# EAGLE design ArduinoProMini_IOShield (EAGLE 8.3.2)
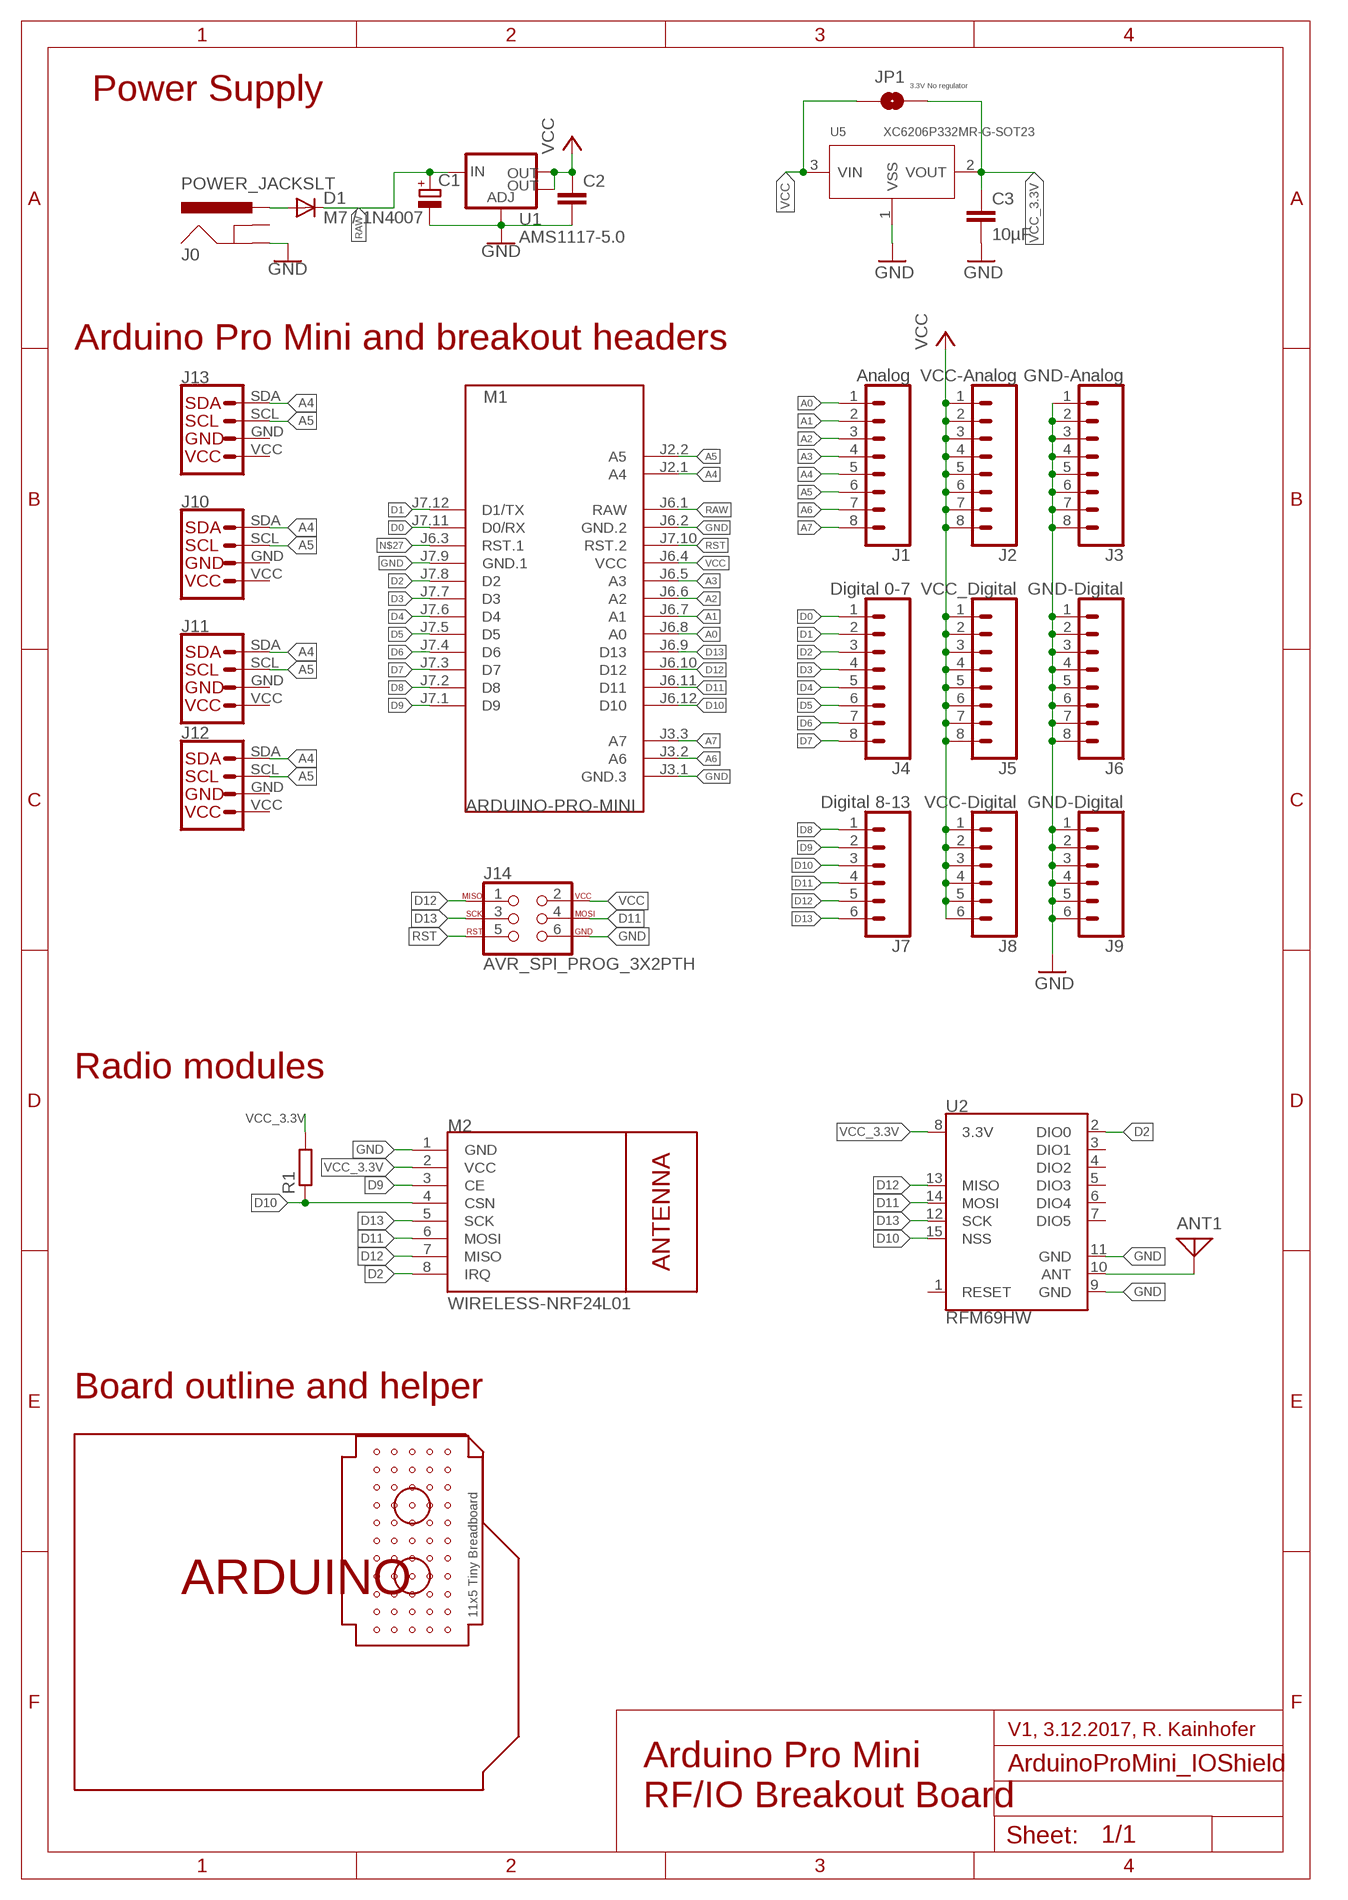
[diagram p0: schematic, sheet 1]

## Parts
ANT1  ANTENNA  [PAD-01]
B1  ARDUINO_DIMENSION-DIMENSION  [ARDUINOR3]
C1  CPOL-EU153CLV-0605  [153CLV-0605]
C2  C-EUC0805  [C0805]
C3  10µF  C-EUC0805  [C0805]
D1  M7 / 1N4007  DIODE-DO-214AC  [DO-214AC]
J0  POWER_JACKSLT  [POWER_JACK_SLOT]
J1  Analog  CONN_08"  [1X08]
J2  VCC-Analog  CONN_08"  [1X08]
J3  GND-Analog  CONN_08"  [1X08]
J4  Digital 0-7  CONN_08"  [1X08]
J5  VCC_Digital  CONN_08"  [1X08]
J6  GND-Digital  CONN_08"  [1X08]
J7  Digital 8-13  CONN_06SILK_FEMALE_PTH  [1X06]
J8  VCC-Digital  CONN_06SILK_FEMALE_PTH  [1X06]
J9  GND-Digital  CONN_06SILK_FEMALE_PTH  [1X06]
J10  I2C_CONN_VGLA  [1X04]
J11  I2C_CONN_VGLA  [1X04]
J12  I2C_CONN_VGLA  [1X04]
J13  I2C_CONN_VGLA  [1X04]
J14  AVR_SPI_PROG_3X2PTH  [2X3]
JP1  3.3V No regulator  JUMPER-SMT_2_NO_SILK  [SMT-JUMPER_2_NO_SILK]
M1  ARDUINO-PRO-MINI  ARDUINO-PRO-MINI-3.3V#NP  [ARDUINO-PRO-MINI#NP]
M2  WIRELESS-NRF24L01  [WIRELESS-NRF24L01]
R1  R-EU_R0805  [R0805]
U1  AMS1117-5.0  V_REG_LM1117SOT223  [SOT223]
U2  RFM69HW  [RFM69W-XXXS2]
U5  XC6206P332MR-G-SOT23  PMIC-LDO-XC6206P332MR-G(SOT23)  [SOT-23]
U$1  MINI_BREADBOARD  [MINI_BREADBOARD_11X5]

## Nets
A0: J1.1 M1.J6.8(A0)
A1: J1.2 M1.J6.7(A1)
A2: J1.3 M1.J6.6(A2)
A3: J1.4 M1.J6.5(A3)
A4: J1.5 J10.SDA J11.SDA J12.SDA J13.SDA M1.J2.1(A4)
A5: J1.6 J10.SCL J11.SCL J12.SCL J13.SCL M1.J2.2(A5)
A6: J1.7 M1.J3.2(A6)
A7: J1.8 M1.J3.3(A7)
D0: J4.1 M1.J7.11(D0/RX)
D1: J4.2 M1.J7.12(D1/TX)
D2: J4.3 M1.J7.8(D2) M2.8(IRQ) U2.2(DIO0)
D3: J4.4 M1.J7.7(D3)
D4: J4.5 M1.J7.6(D4)
D5: J4.6 M1.J7.5(D5)
D6: J4.7 M1.J7.4(D6)
D7: J4.8 M1.J7.3(D7)
D8: J7.1 M1.J7.2(D8)
D9: J7.2 M1.J7.1(D9) M2.3(CE)
D10: J7.3 M1.J6.12(D10) M2.4(CSN) R1.1 U2.15(NSS)
D11: J7.4 J14.4 M1.J6.11(D11) M2.6(MOSI) U2.14(MOSI)
D12: J7.5 J14.1 M1.J6.10(D12) M2.7(MISO) U2.13(MISO)
D13: J7.6 J14.3 M1.J6.9(D13) M2.5(SCK) U2.12(SCK)
GND: C1.- C2.2 C3.2 J0.GND@2(GND) J3.1 J3.2 J3.3 J3.4 J3.5 J3.6 J3.7 J3.8 J6.1 J6.2 J6.3 J6.4 J6.5 J6.6 J6.7 J6.8 J9.1 J9.2 J9.3 J9.4 J9.5 J9.6 J14.6 M1.J3.1(GND.3) M1.J6.2(GND.2) M1.J7.9(GND.1) M2.1(GND) U1.1(ADJ) U2.9(GND) U2.11(GND) U5.1(VSS)
N$1: D1.A J0.PWR
N$23: ANT1.1 U2.10(ANT)
N$27: M1.J6.3(RST.1)
RAW: C1.+ D1.C M1.J6.1(RAW) U1.3(IN)
RST: J14.5 M1.J7.10(RST.2)
VCC: C2.1 J2.1 J2.2 J2.3 J2.4 J2.5 J2.6 J2.7 J2.8 J5.1 J5.2 J5.3 J5.4 J5.5 J5.6 J5.7 J5.8 J8.1 J8.2 J8.3 J8.4 J8.5 J8.6 J14.2 JP1.1 M1.J6.4(VCC) U1.2(OUT) U1.4(OUT) U5.3(VIN)
VCC_3.3V: C3.1 JP1.2 M2.2(VCC) R1.2 U2.8(3.3V) U5.2(VOUT)
Unconnected: J0.GND@1(GNDBREAK) U2.1(RESET) U2.3(DIO1) U2.4(DIO2) U2.5(DIO3) U2.6(DIO4) U2.7(DIO5)

## Notes on the sheet
- Power Supply
- Arduino Pro Mini and breakout headers
- Radio modules
- Board outline and helper
- V1, 3.12.2017, R. Kainhofer
- Arduino Pro Mini 
  RF/IO Breakout Board

## Power pins joined to a net without a drawn wire
GND: J10.GND J11.GND J12.GND J13.GND
VCC: J10.VCC J11.VCC J12.VCC J13.VCC

## Library data of the parts
ANT1 = discrete:ANTENNA: Antenna
B1 = opentools:ARDUINO_DIMENSION: Arduino R3 outline for shields or other PCBs that are supposed to fit the same space as an Arduino.
C1 = resistor:CPOL-EU: POLARIZED CAPACITOR, European symbol
C2 C3 = resistor:C-EU: CAPACITOR, European symbol
D1 = diode:DIODE-: DIODE
J0 = SparkFun-Connectors:POWER_JACK: Power Jack Connector This is the standard 5.5mm barrel jack for power. The PTH is the most common, proven, reliable, footprint. The Slot footprint only works if the mill layer is transmitted to the PCB fab house so be warned. Here are the connectors we sell at SparkFun: DC Barrel Power Jack/Connector <https://www.sparkfun.com/products/119> (PRT-00119) DC Barrel Power Jack/Connector (SMD) <https://www.sparkfun.com/products/12748> (PRT-12748) DC Barrel Jack Adapter - Breadboard Compatible <https://www.sparkfun.com/products/10811> (PRT-10811) It is used on this SparkFun product (and many, many others): SparkFun RedBoard - Programmed with Arduino <https://www.sparkfun.com/products/12757> (DEV-12757) Also, if you need a mating power supply or connector, please check these out: Wall Adapter Power Supply - 9VDC 650mA <https://www.sparkfun.com/products/298> (TOL-00298) DC Barrel Jack Adapter - Male <https://www.sparkfun.com/products/10287> (PRT-10287); PROD_ID: PRT-00119
J1-J6 = SparkFun-Connectors:CONN_08: Multi connection point. Often used as Generic Header-pin footprint for 0.1 inch spaced/style header connections On any of the 0.1 inch spaced packages, you can populate with these: Break Away Headers - Straight <https://www.sparkfun.com/products/116> (PRT-00116) Break Away Male Headers - Right Angle <https://www.sparkfun.com/products/553> (PRT-00553) Female Headers <https://www.sparkfun.com/products/115> (PRT-00115) Break Away Headers - Machine Pin <https://www.sparkfun.com/products/117> (PRT-00117) Break Away Female Headers - Swiss Machine Pin <https://www.sparkfun.com/products/743> (PRT-00743) Arduino Stackable Header - 8 Pin <https://www.sparkfun.com/products/9279> (PRT-09279) For SCREWTERMINALS and SPRING TERMINALS visit here: Screw Terimnals on SparkFun.com <https://www.sparkfun.com/search/results?term=Screw+Terminals> (5mm/3.5mm/2.54mm spacing) This device is also useful as a general connection point to wire up your design to another part of your project. Our various solder wires solder well into these plated through hole pads. Hook-Up Wire - Assortment (Stranded, 22 AWG) <https://www.sparkfun.com/products/11375> (PRT-11375) Hook-Up Wire - Assortment (Solid Core, 22 AWG) <https://www.sparkfun.com/products/11367> (PRT-11367) View the entire wire category on our website here <https://www.sparkfun.com/categories/141> Special notes: Molex polarized connector foot print use with SKU : PRT-08231 with associated crimp pins and housings. 1MM SMD Version SKU: PRT-10208 NOTES ON THE VARIANTS LOCK and LOCK_LONGPADS... This footprint was designed to help hold the alignment of a through-hole component (i.e. 6-pin header) while soldering it into place. You may notice that each hole has been shifted either up or down by 0.005 of an inch from it's more standard position (which is a perfectly straight line). This slight alteration caused the pins (the squares in the middle) to touch the edges of the holes. Because they are alternating, it causes a "brace" to hold the component in place. 0.005 has proven to be the perfect amount of "off-center" position when using our standard breakaway headers. Although looks a little odd when you look at the bare footprint, once you have a header in there, the alteration is very hard to notice. Also,if you push a header all the way into place, it is covered up entirely on the bottom side.; PROD_ID: CONN-08438
J7-J9 = SparkFun-Connectors:CONN_06: Multi connection point. Often used as Generic Header-pin footprint for 0.1 inch spaced/style header connections On any of the 0.1 inch spaced packages, you can populate with these: Break Away Headers - Straight <https://www.sparkfun.com/products/116> (PRT-00116) Break Away Male Headers - Right Angle <https://www.sparkfun.com/products/553> (PRT-00553) Female Headers <https://www.sparkfun.com/products/115> (PRT-00115) Break Away Headers - Machine Pin <https://www.sparkfun.com/products/117> (PRT-00117) Break Away Female Headers - Swiss Machine Pin <https://www.sparkfun.com/products/743> (PRT-00743) Arduino Stackable Header - 6 Pin <https://www.sparkfun.com/products/9280> (PRT-09280) For SCREWTERMINALS and SPRING TERMINALS visit here: Screw Terimnals on SparkFun.com <https://www.sparkfun.com/search/results?term=Screw+Terminals> (5mm/3.5mm/2.54mm spacing) This device is also useful as a general connection point to wire up your design to another part of your project. Our various solder wires solder well into these plated through hole pads. Hook-Up Wire - Assortment (Stranded, 22 AWG) <https://www.sparkfun.com/products/11375> (PRT-11375) Hook-Up Wire - Assortment (Solid Core, 22 AWG) <https://www.sparkfun.com/products/11367> (PRT-11367) View the entire wire category on our website here <https://www.sparkfun.com/categories/141>; PROD_ID: CONN-08437
J10-J13 = opentools:I2C_CONN_VGLA: I2C Standard Pinout Header Standardized pinout for all I2C based sensor breakouts. This pinout allows I2C boards to be plugged directly into the headers on Arduino Uno compatible boards, and to be daisy chained easily. The order of the I2C pins is: VCC GND SCL SDA
J14 = SparkFun-Connectors:AVR_SPI_PROG_3X2: AVR ISP 6 Pin This is the reduced ISP connector for AVR programming. Common on Arduino. This footprint will take up less PCB space and can be used with a 10-pin to 6-pin adapter such as SKU: BOB-08508 **Special note about "TEST_POINT" package. The stop mask is on the top side, so if you want your programming test points to be on the bottom of your board, make sure to place this package on the bottom side of the board. This also ensure that the orientation to program from the bottom side will be correct. SparkFun Products: SparkFun ISP Pogo Adapter <https://www.sparkfun.com/products/11591> - NS Tiny AVR Programmer <https://www.sparkfun.com/products/11801> -PTH
JP1 = SparkFun-Jumpers:JUMPER-SMT_2_NO: Normally open jumper This jumper has two pads in close proximity to each other. Apply solder to close the connection. Round pads are easier to solder for beginners, but are a lot larger. SparkFun Product that uses the round pads: SparkFun EL Sequencer <https://www.sparkfun.com/products/12781>
M1 = diy-modules:ARDUINO-PRO-MINI-*#NP: Arduino Pro Mini (and compatible devices) without programming pads More details available here: https://www.arduino.cc/en/Main/ArduinoBoardProMini Click here to find device on ebay.com <http://www.ebay.com/sch/arduino+pro+mini>
M2 = diy-modules:WIRELESS-NRF24L01: 2.4 GHz Wireless Module based on NRF24L01 chip More details available here: http://www.electrodragon.com/w/NRF24L01 Click here to find device on ebay.com <http://www.ebay.com/sch/nrf24l01+arduino>
R1 = resistor:R-EU_: RESISTOR, European symbol
U1 = SparkFun-IC-Power:V_REG_LM1117: Voltage Regulator LM1117 Standard adjustable voltage regulator but in SMD form. Spark Fun Electronics SKU : COM-00595; PROD_ID: VREG-08170
U2 = SparkFun-RF:RFM69H: Hope RF RFM69H ISM Transceiver Module The RFM69H is a transceiver module capable of operation over a wide frequency range, including the 315,433,868 and 915MHz license-free ISM (Industry Scientific and Medical) frequency bands. All major RF communication parameters are programmable and most of them can be dynamically set. The RFM69H offers the unique advantage of programmable narrow-band and wide- band communication modes. The RFM69H is optimized for low power consumption while offering high RF output power and channelized operation.Compliance ETSI and FCC regulations. Datasheet <http://www.hoperf.cn/upload/docs/RF/SX/RFM69H_DataSheet_v1.3.pdf> SparkFun Products RFM69HCW Wireless Transceiver - 915MHz <https://www.sparkfun.com/products/13909> (COM-13909) RFM69HCW Wireless Transceiver - 434MHz <https://www.sparkfun.com/products/13910> (COM-13910) SparkFun RFM69 Breakout (915MHz) <https://www.sparkfun.com/products/12775> (WRL-12775) SparkFun RFM69 Breakout (434MHz) <https://www.sparkfun.com/products/12823> (WRL-12823)
U5 = Seeed-IC:PMIC-LDO-XC6206P332MR-G(SOT23): 310030099; MPN: XC6206P332MR-G
U$1 = opentools:MINI_BREADBOARD: 5x11 pin tiny breadboard with 2 nipples at the back for the Magic Breadboard Mama Board

## Net classes
0 default: width 0.305 mm, clearance 0.152 mm
1 GND: width 0.305 mm, clearance 0.152 mm

## Board
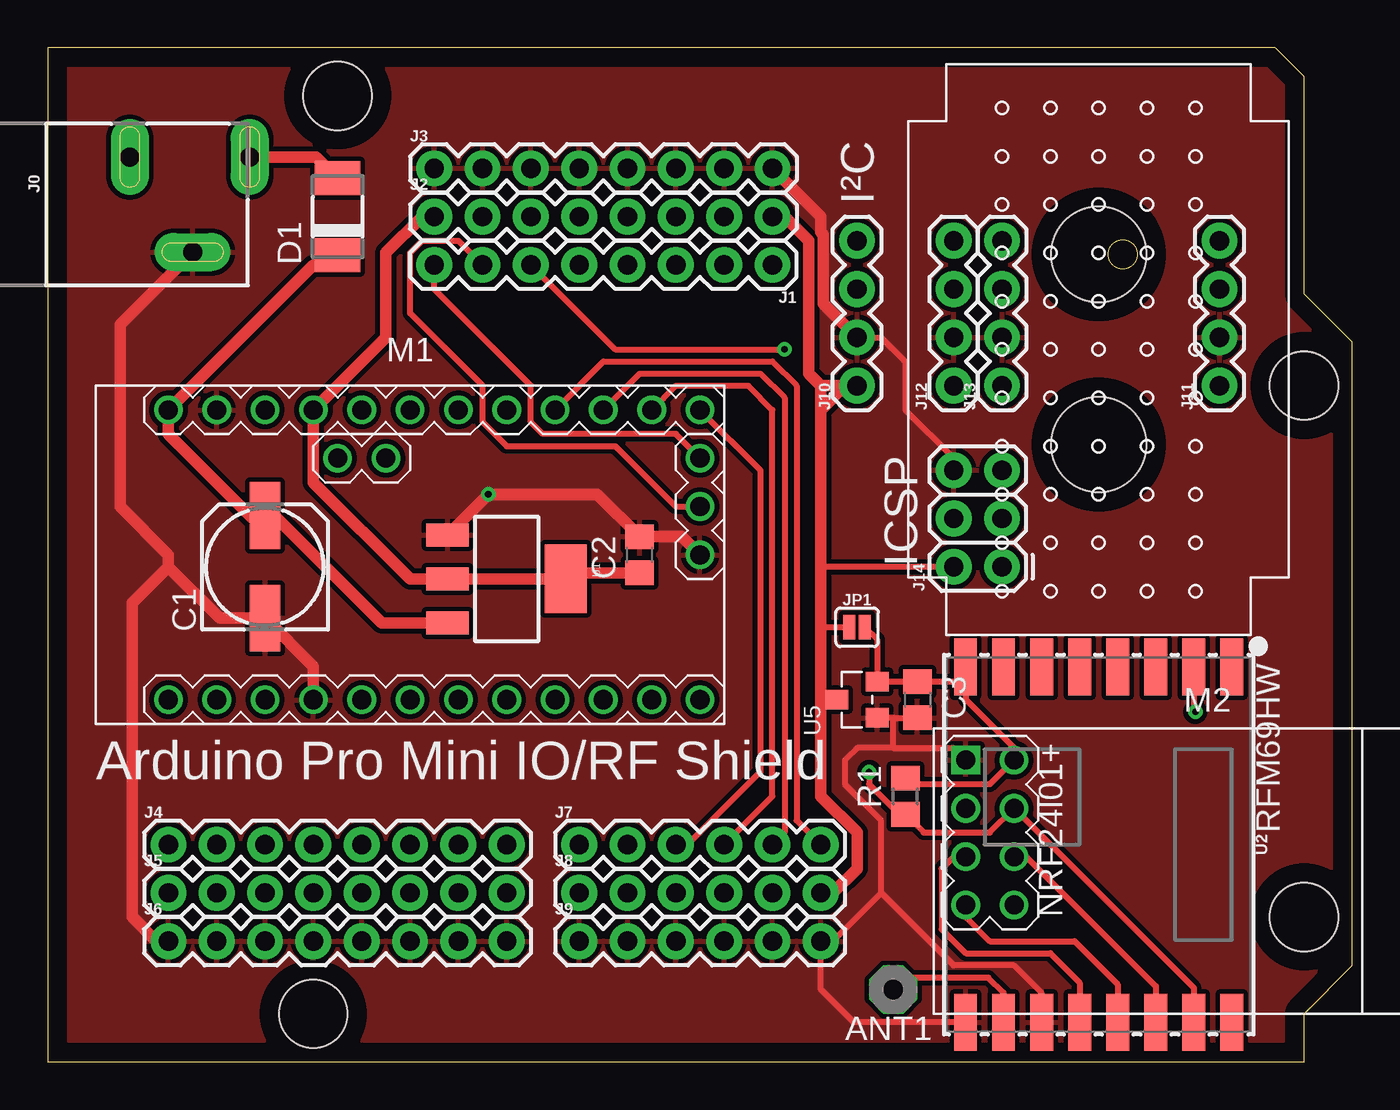
[diagram p1: board, top side]
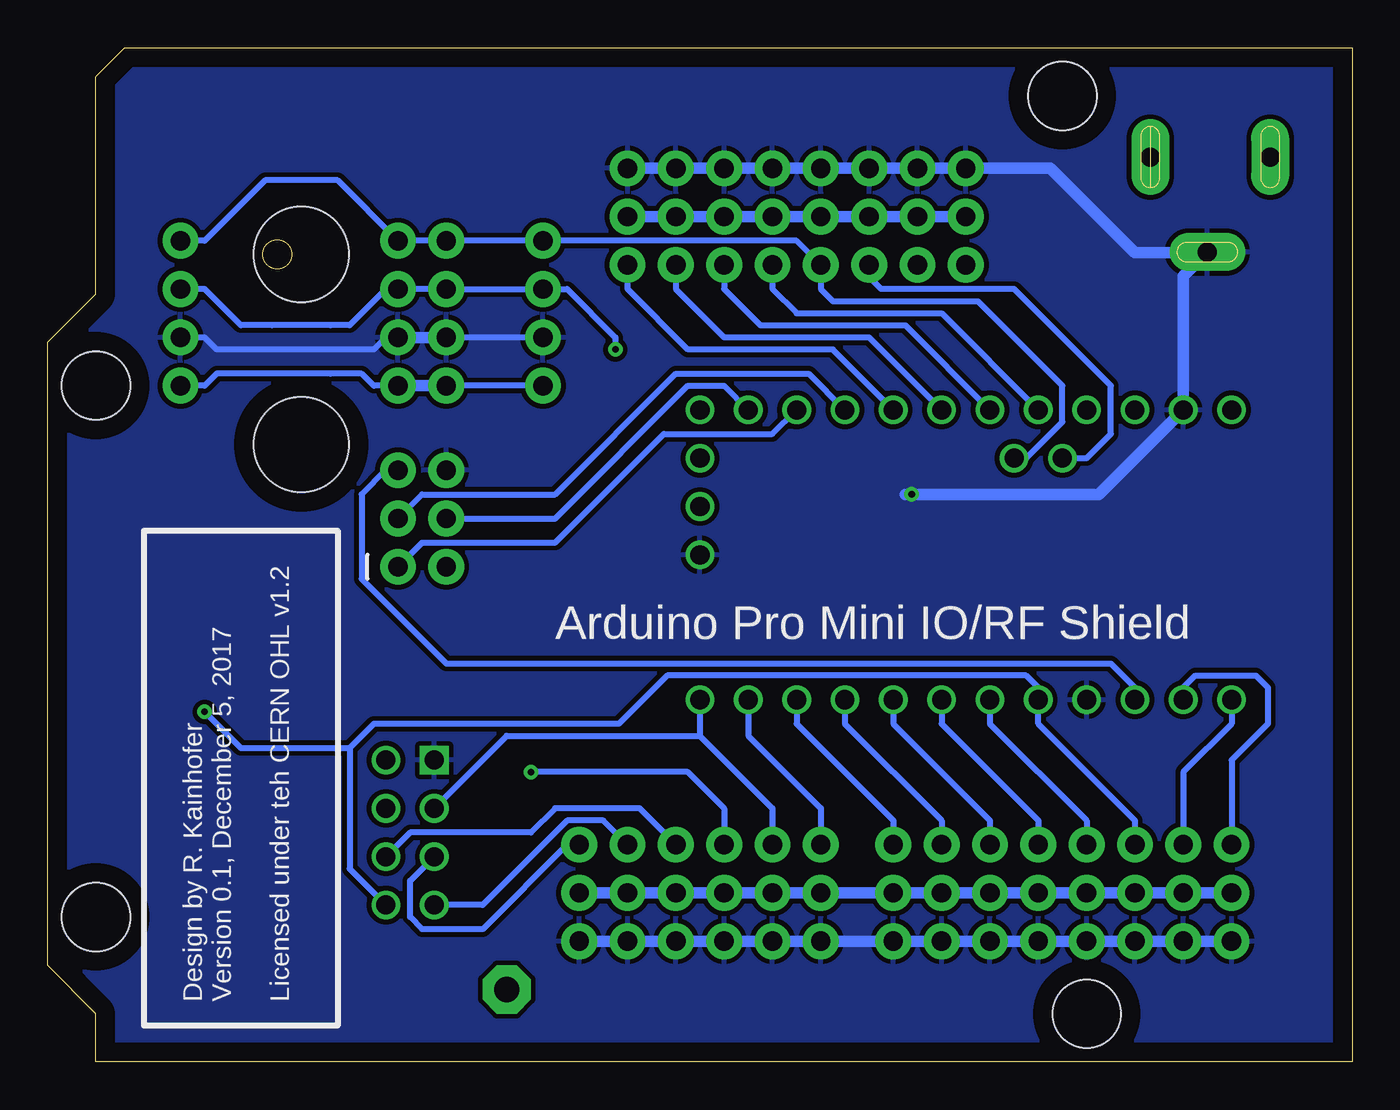
[diagram p2: board, bottom side, seen from below]

Size 68.58 x 53.34 mm. Coordinates in mm from the lower left corner, seen from the top.
Copper layers (1*16): Top 0.035mm / dielectric 1.5mm / Bottom 0.035mm
Design rules "default *": minimum track width 6mil, minimum drill 0.35mm, track to track 6mil, track to pad 6mil, pad to pad 6mil, via to via 6mil, smd to smd 6mil, copper to edge 40mil, drill to drill 6mil, minimum pad ring 10mil, minimum via ring 8mil, stop-mask expansion 4mil, vias tented up to drill 100mil, thermal gap 10mil

### Footprints (pad centres in the part's own frame; a part is rotated, then mirrored left to right if it is on the bottom)
PAD-01 = drill 1.321 pad 2.54 octagon: 1 0,0
ARDUINOR3 = hole 3.592: 15.24,50.8; 66.04,35.56; 13.97,2.54; 66.04,7.62
153CLV-0605 = smd 3.5 x 1.6: + 2.7,0; - -2.7,0
C0805 = smd 1.3 x 1.5: 1 -0.95,0; 2 0.95,0
DO-214AC = smd 1.8 x 2.4: A 2.025,0; C -2.025,0
POWER_JACK_SLOT = drill 1 pad 2 long: GND@1 2.58,7.5; GND@2 7.58,10.8; PWR 2.58,13.8
1X08 = drill 1.016 pad 1.88: 1 0,0; 2 2.54,0; 3 5.08,0; 4 7.62,0; 5 10.16,0; 6 12.7,0; 7 15.24,0; 8 17.78,0
1X06 = drill 1.016 pad 1.88: 1 0,0; 2 2.54,0; 3 5.08,0; 4 7.62,0; 5 10.16,0; 6 12.7,0
1X04 = drill 1.016 pad 1.88: GND 2.54,0; SCL 5.08,0; SDA 7.62,0; VCC 0,0
2X3 = drill 1.016 pad 1.88: 1 0,0; 2 0,2.54; 3 2.54,0; 4 2.54,2.54; 5 5.08,0; 6 5.08,2.54
SMT-JUMPER_2_NO_SILK = smd 0.635 x 1.27: 1 -0.406,0; 2 0.406,0
ARDUINO-PRO-MINI#NP = drill 1: J2.1 -1.27,5.08; J2.2 -3.81,5.08; J3.1 15.24,0; J3.2 15.24,2.54; J3.3 15.24,5.08; J6.1 -12.7,7.62; J6.2 -10.16,7.62; J6.3 -7.62,7.62; J6.4 -5.08,7.62; J6.5 -2.54,7.62; J6.6 0,7.62; J6.7 2.54,7.62; J6.8 5.08,7.62; J6.9 7.62,7.62; J6.10 10.16,7.62; J6.11 12.7,7.62; J6.12 15.24,7.62; J7.1 15.24,-7.62; J7.2 12.7,-7.62; J7.3 10.16,-7.62; J7.4 7.62,-7.62; J7.5 5.08,-7.62; J7.6 2.54,-7.62; J7.7 0,-7.62; J7.8 -2.54,-7.62; J7.9 -5.08,-7.62; J7.10 -7.62,-7.62; J7.11 -10.16,-7.62; J7.12 -12.7,-7.62
WIRELESS-NRF24L01 = drill 1 square: 1 -12.7,6.35 | drill 1: 2 -10.16,6.35; 3 -12.7,3.81; 4 -10.16,3.81; 5 -12.7,1.27; 6 -10.16,1.27; 7 -12.7,-1.27; 8 -10.16,-1.27
R0805 = smd 1.3 x 1.5: 1 -0.95,0; 2 0.95,0
SOT223 = smd 1.219 x 2.235: 1 -2.311,-3.099; 2 0,-3.099; 3 2.311,-3.099 | smd 3.6 x 2.2: 4 0,3.099
RFM69W-XXXS2 = smd 3 x 1.2: 1 -9.35,7; 2 -9.35,5; 3 -9.35,3; 4 -9.35,1; 5 -9.35,-1; 6 -9.35,-3; 7 -9.35,-5; 8 -9.35,-7; 9 9.35,-7; 10 9.35,-5; 11 9.35,-3; 12 9.35,-1; 13 9.35,1; 14 9.35,3; 15 9.35,5; 16 9.35,7
SOT-23 = smd 1.016 x 1.2: 1 -0.95,-1.06; 2 0.95,-1.06; 3 0,1.06
MINI_BREADBOARD_11X5 = hole 5: -5,0; 5,0

### Placement (x,y rotation side)
ANT1  44.45,3.81 0 top
B1  0,0 0 top
C1  11.43,26.04 90 top
C2  31.11,26.67 90 top
C3  45.72,19.05 270 top
D1  15.24,44.45 90 top
J0  -3.17,50.16 270 top
J1  38.1,41.91 180 top
J2  20.32,44.45 0 top
J3  20.32,46.99 0 top
J4  6.35,11.43 0 top
J5  6.35,8.89 0 top
J6  6.35,6.35 0 top
J7  27.94,11.43 0 top
J8  27.94,8.89 0 top
J9  27.94,6.35 0 top
J10  42.55,35.56 90 top
J11  61.59,35.56 90 top
J12  47.62,35.56 90 top
J13  50.16,35.56 90 top
J14  50.16,26.04 90 top
JP1  42.55,22.86 0 top
M1  19.05,26.67 0 top
M2  60.96,9.53 0 top
R1  45.09,13.97 90 top
U1  24.13,25.4 270 top
U2  55.24,11.43 270 top
U5  42.55,19.05 90 top
U$1  55.24,37.47 270 top

### Tracks (layer width: path | path; a pad name or v marks a point on that pad's centre or on a via)
A0
  Bottom 0.305: J1.1 38.1,40.64 34.92,37.47 27.3,37.47 M1.J6.8
A1
  Bottom 0.305: J1.2 35.56,40.64 33.02,38.1 25.4,38.1 M1.J6.7
A2
  Bottom 0.305: M1.J6.6 23.5,38.73 31.11,38.73 33.02,40.64 J1.3
A3
  Bottom 0.305: M1.J6.5 21.59,39.37 29.21,39.37 30.48,40.64 J1.4
A4
  Bottom 0.305: J11.SDA 60.33,43.18 57.15,46.35 53.34,46.35 J13.SDA J12.SDA J10.SDA 29.21,43.18 J1.5 27.94,40.64 27.3,40.01 19.68,40.01 15.24,35.56 15.24,33.66 17.14,31.75 M1.J2.1
A5  (via drill 0.35)
  Top 0.305: J1.6 29.84,37.47 v38.73,37.47
  Bottom 0.305: J1.6 25.4,41.27 24.77,40.64 17.78,40.64 12.7,35.56 12.7,33.02 13.97,31.75 M1.J2.2 | J11.SCL 60.33,40.64 58.42,38.73 56.79,38.73 53.7,38.73 52.7,38.73 50.8,40.64 J13.SCL J12.SCL J10.SCL 41.27,40.64 38.73,38.1 v38.73,37.47
A6
  Top 0.305: J1.7 21.59,43.18 19.68,43.18 19.05,42.55 19.05,39.37 22.86,35.56 22.86,33.66 24.13,32.38 29.84,32.38 33.02,29.21 M1.J3.2
A7
  Top 0.305: M1.J3.3 33.02,33.02 26.04,33.02 25.4,33.66 25.4,35.56 20.32,40.64 J1.8
D0
  Bottom 0.305: J4.1 6.35,15.88 4.45,17.78 4.45,19.68 5.08,20.32 8.26,20.32 8.89,19.68 M1.J7.11
D1
  Bottom 0.305: J4.2 8.89,15.24 6.35,17.78 M1.J7.12
D2  (via drill 0.35)
  Top 0.305: U2.2 60.24,18.5 v60.33,18.41
  Bottom 0.305: M2.8 52.7,10.16 52.7,16.51 | 52.7,16.51 51.44,17.78 38.56,17.78 36.02,20.32 17.14,20.32 16.51,19.68 M1.J7.8 16.51,17.78 11.43,12.7 J4.3 | v60.33,18.41 58.42,16.51 52.7,16.51
D3
  Bottom 0.305: J4.4 13.97,12.7 19.05,17.78 M1.J7.7
D4
  Bottom 0.305: J4.5 16.51,12.7 21.59,17.78 M1.J7.6
D5
  Bottom 0.305: J4.6 19.05,12.7 24.13,17.78 M1.J7.5
D6
  Bottom 0.305: J4.7 21.59,12.7 26.67,17.78 M1.J7.4
D7
  Bottom 0.305: J4.8 24.13,12.7 29.21,17.78 M1.J7.3
D8
  Bottom 0.305: J7.1 27.94,13.34 31.75,17.14 M1.J7.2
D9
  Bottom 0.305: 45.72,15.88 M2.3 | J7.2 30.48,13.34 34.29,17.14 | M2.3 45.09,16.51 | M2.3 44.45,17.14 34.29,17.14 | M1.J7.1 34.29,17.14
D10  (via drill 0.35)
  Top 0.305: U2.15 60.24,3.89 M2.4 49.53,12.06 46.04,12.06 R1.1 44.77,13.02 43.18,14.61 v43.18,15.24 | M1.J6.12 37.47,31.11 37.47,15.24 33.66,11.43 J7.3
  Bottom 0.305: J7.3 33.02,13.34 34.92,15.24 v43.18,15.24
D11
  Top 0.305: M2.6 51.44,10.79 58.24,3.98 U2.14 | M1.J6.11 33.02,35.56 36.83,35.56 38.1,34.29 38.1,13.97 J7.4
  Bottom 0.305: M2.6 49.53,12.06 43.18,12.06 41.91,13.34 37.47,13.34 J7.4 | M1.J6.11 33.02,35.56 34.92,35.56 41.91,28.57 J14.4
D12
  Top 0.305: J7.5 38.73,12.06 38.73,34.92 37.47,36.2 31.11,36.2 M1.J6.10 | M2.7 48.26,7.62 49.53,6.35 53.98,6.35 56.24,4.08 U2.13
  Bottom 0.305: M2.7 45.72,8.26 41.27,12.7 39.37,12.7 J7.5 | J14.1 48.9,27.3 41.91,27.3 36.2,33.02 30.48,33.02 M1.J6.10
D13
  Top 0.305: M2.5 47.62,10.79 46.99,10.16 46.99,6.99 48.26,5.71 52.7,5.71 54.24,4.17 U2.12 | M1.J6.9 29.21,36.83 38.1,36.83 39.37,35.56 39.37,12.7 J7.6
  Bottom 0.305: J7.6 41.27,11.43 45.72,6.99 48.9,6.99 49.53,7.62 49.53,9.53 M2.5 | J14.3 48.9,29.84 41.91,29.84 35.56,36.2 28.57,36.2 M1.J6.9
GND  (via drill 0.35)
  Top 0.305: 52.07,2.25 U2.11 52.24,3.63 50.8,5.08 47.62,5.08 43.81,8.89 | M2.1 47.62,16.51 44.45,16.51 | 44.45,18.1 U5.1 | 44.45,18.1 C3.2 | 44.45,16.51 44.45,18.1 | 44.45,16.51 42.55,16.51 41.91,15.88 41.91,14.61 43.81,12.7 43.81,8.89 | 43.81,8.89 41.27,6.35 J9.6 40.64,3.81 42.37,2.08 U2.9 | J10.GND 43.81,38.1 45.09,36.83 45.09,34.29 47.62,31.75 J14.6
  Top 0.61: 6.35,26.04 9.05,23.34 C1.- 13.97,20.8 M1.J7.9 | U1.1 v23.16,29.84 28.89,29.84 C2.2 33.34,27.62 M1.J3.1 | J6.1 5.71,6.35 4.45,7.62 4.45,24.13 6.35,26.04 | 6.35,26.04 6.35,26.67 3.81,29.21 3.81,38.77 J0.GND@2 | J10.GND 40.77,39.88 40.77,43.5 40.64,43.62 40.64,44.45 J3.8
  Bottom 0.305: J13.GND 50.8,38.1 51.44,37.47 59.69,37.47 60.33,38.1 J11.GND | J10.GND J12.GND
  Bottom 0.61: J6.1 J6.2 J6.3 J6.4 J6.5 J6.6 J6.7 J6.8 J9.1 J9.2 J9.3 J9.4 J9.5 J9.6 | J3.8 J3.7 J3.6 J3.5 J3.4 J3.3 J3.2 J3.1 15.88,46.99 11.43,42.55 7.67,42.55 J0.GND@2 8.89,41.32 M1.J6.2 13.34,29.84 v23.16,29.84 23.5,29.84 | J12.GND J13.GND
  pour Top (isolate 0.254): 0,53.34 64.14,53.34 66.04,51.44 66.04,40.01 68.58,37.47 68.58,5.08 66.04,2.54 66.04,0 0,0
  pour Bottom (isolate 0.254): 0,53.34 64.77,53.34 66.04,51.44 66.04,40.01 68.58,37.47 68.58,5.08 66.04,2.54 66.04,0 0,0
N$1
  Top 0.61: J0.PWR 14.13,47.59 D1.A
N$23
  Top 0.305: U2.10 50.24,3.64 49.45,4.43 45.08,4.43 ANT1.1
RAW
  Top 0.61: U1.3 17.55,23.09 11.9,28.73 C1.+ 11.27,28.57 10.79,28.57 6.35,33.02 M1.J6.1 13.97,41.91 14.72,41.91 D1.C
RST
  Bottom 0.305: J14.5 50.8,31.11 52.07,29.84 52.07,25.4 47.62,20.95 12.7,20.95 11.43,19.68 M1.J7.10
VCC
  Top 0.305: 40.64,19.05 U5.3 | JP1.1 40.64,22.86 | J14.2 40.64,26.04
  Top 0.61: C2.1 27.55,25.72 U1.4 U1.2 19.05,25.4 13.97,30.48 M1.J6.4 17.78,38.1 17.78,42.55 19.68,44.45 J2.1 | J2.8 38.73,44.45 40.01,43.18 40.01,36.2 40.64,35.56 | 40.64,34.29 40.64,26.04 40.64,22.86 40.64,19.05 40.64,13.97 42.55,12.06 42.55,10.16 41.27,8.89 J8.6 | 40.64,35.56 J10.VCC 41.91,35.56 40.64,34.29 | 40.64,35.56 40.64,34.29
  Bottom 0.305: J13.VCC 51.44,35.56 52.07,36.2 53.7,36.2 59.69,36.2 60.33,35.56 J11.VCC | J10.VCC J12.VCC
  Bottom 0.61: J5.3 12.06,8.89 | J5.1 J5.2 J5.3 | J5.3 J5.4 J5.5 J5.6 J5.7 J5.8 J8.1 J8.2 J8.3 J8.4 J8.5 J8.6 | J2.1 J2.2 J2.3 J2.4 J2.5 J2.6 J2.7 J2.8 | J12.VCC J13.VCC
VCC_3.3V
  Top 0.305: JP1.2 43.6,22.21 U5.2 C3.1 48.1,20 U2.8 48.24,19.07 50.8,16.51 M2.2 49.53,14.61 45.41,14.61 R1.2

### Text on the board
tOrigins: VCC 6-40V | G | V | SDA | SDA | S | SCL | SCL | A7 | A6 | A5 | A4 | A3 | A2 | A1 | A0 | GND | GND | VCC | VCC | D0 | D1 | D2 | D3 | D4 | D5 | D6 | D7 | D8 | D9 | D10 | D11 | D12 | D13 | S | V | G
tNames: I²C | ICSP | RFM69HW | Arduino Pro Mini IO/RF Shield | NRF24l01+
bNames: Arduino Pro Mini IO/RF Shield | Design by R. Kainhofer / Version 0.1, December 5, 2017 / / Licensed under teh CERN OHL v1.2